# EAGLE design HighSideBoard (EAGLE 5.10)
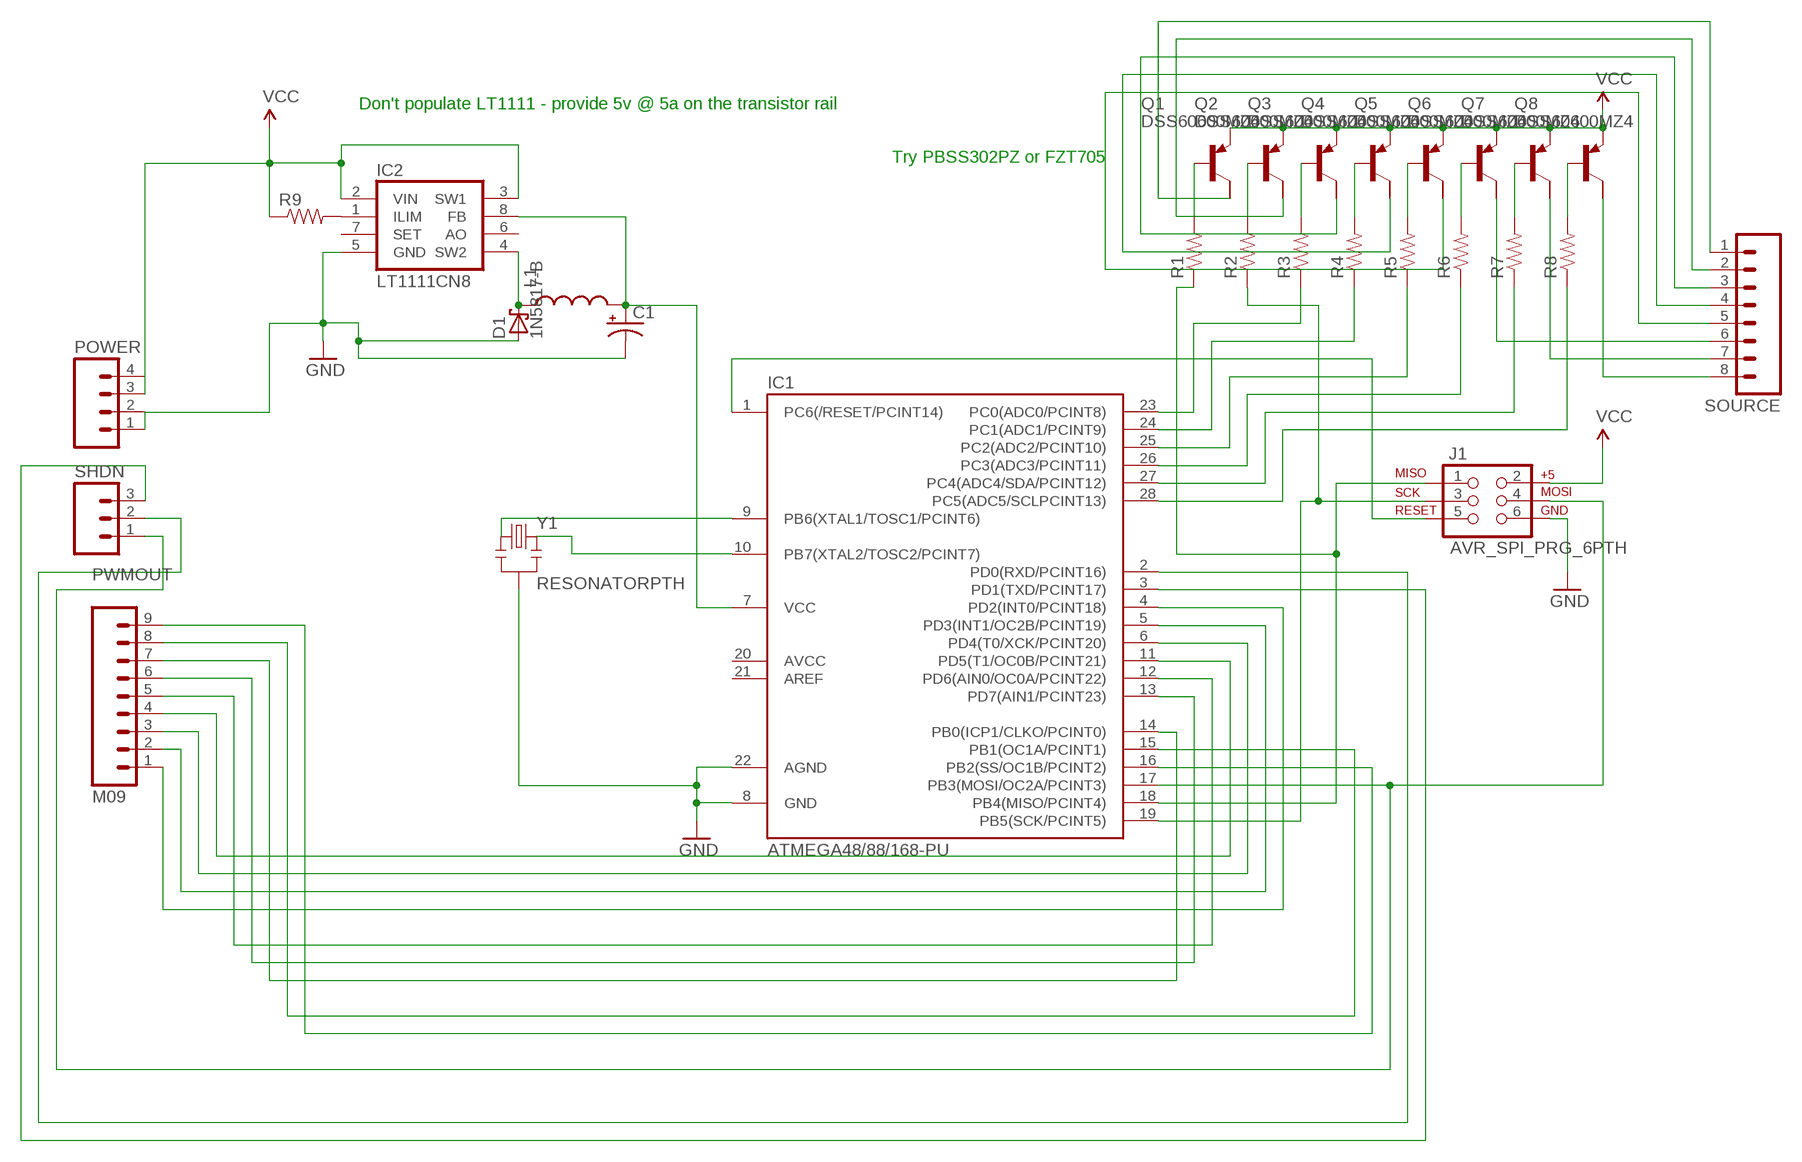
[diagram p0: schematic, sheet 1]

## Parts
C1  CAP_POLPTH2  [CPOL-RADIAL-10UF-25V]
D1  1N5817-B  [DO41-7.6]
IC1  ATMEGA48/88/168-PU  [DIL28-3]
IC2  LT1111CN8  [DIL08]
J1  AVR_SPI_PRG_6PTH  [2X3]
L1  INDUCTORCR75  [CR75]
POWER  M04PTH  [1X04]
PWMOUT  M09  [1X09]
Q1  DSS60600MZ4  FZT753SMD  [SOT223]
Q2  DSS60600MZ4  FZT753SMD  [SOT223]
Q3  DSS60600MZ4  FZT753SMD  [SOT223]
Q4  DSS60600MZ4  FZT753SMD  [SOT223]
Q5  DSS60600MZ4  FZT753SMD  [SOT223]
Q6  DSS60600MZ4  FZT753SMD  [SOT223]
Q7  DSS60600MZ4  FZT753SMD  [SOT223]
Q8  DSS60600MZ4  FZT753SMD  [SOT223]
R1  RESISTORAXIAL-0.3  [AXIAL-0.3]
R2  RESISTORAXIAL-0.3  [AXIAL-0.3]
R3  RESISTORAXIAL-0.3  [AXIAL-0.3]
R4  RESISTORAXIAL-0.3  [AXIAL-0.3]
R5  RESISTORAXIAL-0.3  [AXIAL-0.3]
R6  RESISTORAXIAL-0.3  [AXIAL-0.3]
R7  RESISTORAXIAL-0.3  [AXIAL-0.3]
R8  RESISTORAXIAL-0.3  [AXIAL-0.3]
R9  RESISTORAXIAL-0.3  [AXIAL-0.3]
SHDN  M03PTH  [1X03]
SOURCE  M081X08  [1X08]
Y1  RESONATORPTH  [RESONATOR-PTH]

## Nets
GND: C1.2(-) D1.A IC1.8(GND) IC1.22(AGND) IC2.5(GND) J1.6 POWER.1 POWER.2 Y1.2
N$1: IC1.18(PB4(MISO/PCINT4)) J1.1 R1.P$1
N$2: IC1.19(PB5(SCK/PCINT5)) J1.3 R2.P$1
N$3: IC1.1(PC6(/RESET/PCINT14)) J1.5
N$4: IC1.17(PB3(MOSI/OC2A/PCINT3)) J1.4 SHDN.1
N$5: IC1.4(PD2(INT0/PCINT18)) PWMOUT.1
N$6: IC1.5(PD3(INT1/OC2B/PCINT19)) PWMOUT.2
N$7: IC1.6(PD4(T0/XCK/PCINT20)) PWMOUT.3
N$8: IC1.11(PD5(T1/OC0B/PCINT21)) PWMOUT.4
N$9: IC1.12(PD6(AIN0/OC0A/PCINT22)) PWMOUT.5
N$10: IC1.13(PD7(AIN1/PCINT23)) PWMOUT.6
N$11: IC1.14(PB0(ICP1/CLKO/PCINT0)) PWMOUT.7
N$12: IC1.15(PB1(OC1A/PCINT1)) PWMOUT.8
N$13: IC1.16(PB2(SS/OC1B/PCINT2)) PWMOUT.9
N$14: IC1.9(PB6(XTAL1/TOSC1/PCINT6)) Y1.1
N$15: IC1.10(PB7(XTAL2/TOSC2/PCINT7)) Y1.3
N$16: Q1.1(B) R1.P$2
N$17: Q2.1(B) R2.P$2
N$18: Q3.1(B) R3.P$2
N$19: Q4.1(B) R4.P$2
N$20: Q5.1(B) R5.P$2
N$21: Q6.1(B) R6.P$2
N$22: Q7.1(B) R7.P$2
N$23: Q8.1(B) R8.P$2
N$24: IC1.28(PC5(ADC5/SCLPCINT13)) R8.P$1
N$25: IC1.27(PC4(ADC4/SDA/PCINT12)) R7.P$1
N$26: IC1.26(PC3(ADC3/PCINT11)) R6.P$1
N$27: IC1.25(PC2(ADC2/PCINT10)) R5.P$1
N$28: IC1.24(PC1(ADC1/PCINT9)) R4.P$1
N$29: IC1.23(PC0(ADC0/PCINT8)) R3.P$1
N$30: Q5.2(C) SOURCE.5
N$31: Q6.2(C) SOURCE.6
N$32: Q1.2(C) SOURCE.1
N$33: Q2.2(C) SOURCE.2
N$34: Q3.2(C) SOURCE.3
N$35: Q4.2(C) SOURCE.4
N$36: Q7.2(C) SOURCE.7
N$37: Q8.2(C) SOURCE.8
N$38: IC2.1(ILIM) R9.P$2
N$39: D1.C IC2.4(SW2) L1.P$1
N$40: C1.1(+) IC1.7(VCC) IC2.8(FB) L1.P$2
N$41: IC1.2(PD0(RXD/PCINT16)) SHDN.2
N$42: IC1.3(PD1(TXD/PCINT17)) SHDN.3
VCC: IC2.2(VIN) IC2.3(SW1) J1.2 POWER.3 POWER.4 Q1.3(E) Q2.3(E) Q3.3(E) Q4.3(E) Q5.3(E) Q6.3(E) Q7.3(E) Q8.3(E) R9.P$1
Unconnected: IC1.20(AVCC) IC1.21(AREF) IC2.6(AO) IC2.7(SET) Q1.4(C/) Q2.4(C/) Q3.4(C/) Q4.4(C/) Q5.4(C/) Q6.4(C/) Q7.4(C/) Q8.4(C/)

## Notes on the sheet
- Don't populate LT1111 - provide 5v @ 5a on the transistor rail
- Try PBSS302PZ or FZT705

## Library data of the parts
C1 = SparkFun:CAP_POL: Capacitor Polarized These are standard SMD and PTH capacitors. Normally 10uF, 47uF, and 100uF in electrolytic and tantalum varieties. Always verify the external diameter of the through hole cap, it varies with capacity, voltage, and manufacturer. The EIA devices should be standard.
D1 = diode:1N581*: 1.0A SCHOTTKY BARRIER RECTIFIER Source: http://www.diodes.com/datasheets/ds23001.pdf
IC1 = atmega8:ATMEGA48/88/168-PU
IC2 = linear-technology-2:LT1111*: Micropower DC/DC Converter Adjustable and Fixed 5V, 12V
J1 = SparkFun:AVR_SPI_PRG_6: AVR ISP 6 Pin This is the reduced ISP connector for AVR programming. Common on Arduino. This footprint will take up less PCB space and can be used with a 10-pin to 6-pin adapter such as SKU: BOB-08508
L1 = SparkFun:INDUCTOR: Inductors Basic Inductor/Choke - 0603 and 1206. Footprints are not proven and vary greatly between part numbers.
POWER = SparkFun:M04: Header 4 Standard 4-pin 0.1" header. Use with straight break away headers (SKU : PRT-00116), right angle break away headers (PRT-00553), swiss pins (PRT-00743), machine pins (PRT-00117), and female headers (PRT-00115). Molex polarized connector foot print use with SKU : PRT-08231 with associated crimp pins and housings. 1MM SMD Version SKU: PRT-10208
PWMOUT = SparkFun:M09: Header 9 Standard 9-pin 0.1" header. Use with straight break away headers (SKU : PRT-00116), right angle break away headers (PRT-00553), swiss pins (PRT-00743), machine pins (PRT-00117), and female headers (PRT-00115).
Q1-Q8 = transistor-pnp:FZT753SMD: PNP Transistor
R1-R9 = SparkFun:RESISTOR: Resistor Basic schematic elements and footprints for 0603, 1206, and PTH resistors.
SHDN = SparkFun:M03: Header 3 Standard 3-pin 0.1" header. Use with straight break away headers (SKU : PRT-00116), right angle break away headers (PRT-00553), swiss pins (PRT-00743), machine pins (PRT-00117), and female headers (PRT-00115). Molex polarized connector foot print use with SKU : PRT-08232 with associated crimp pins and housings.
SOURCE = SparkFun:M08: Header 8 Standard 8-pin 0.1" header. Use with straight break away headers (SKU : PRT-00116), right angle break away headers (PRT-00553), swiss pins (PRT-00743), machine pins (PRT-00117), and female headers (PRT-00115).
Y1 = SparkFun:RESONATOR: Resonator Small SMD resonator. This is the itty bitty 10/20MHz resonators with built in caps. CSTCE10M0G55 and CSTCE20M0V53. Footprint has been reviewed closely but hasn't been tested yet.

## Board
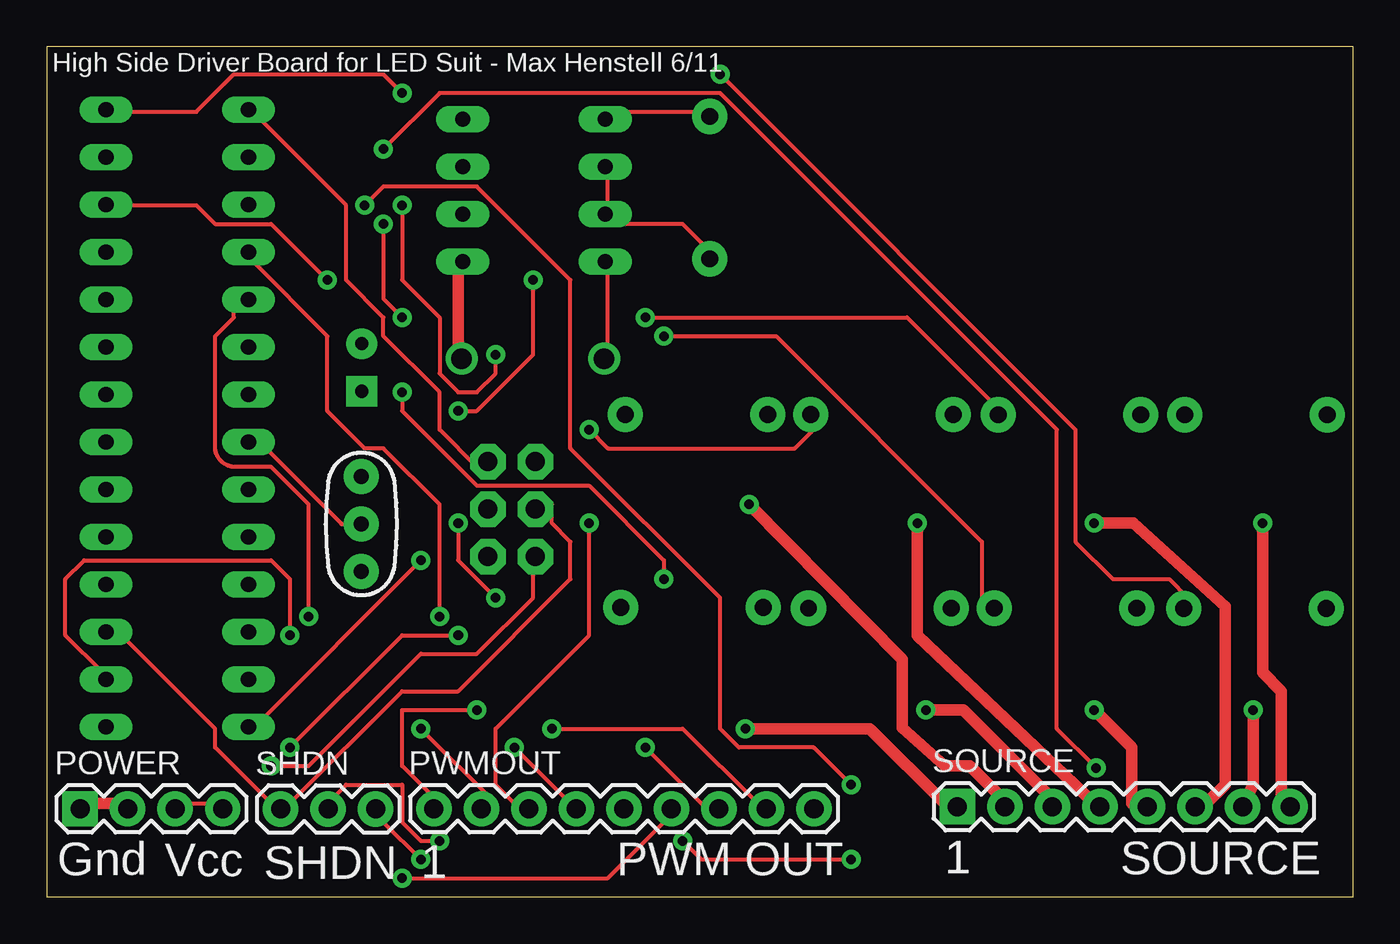
[diagram p1: board, top side]
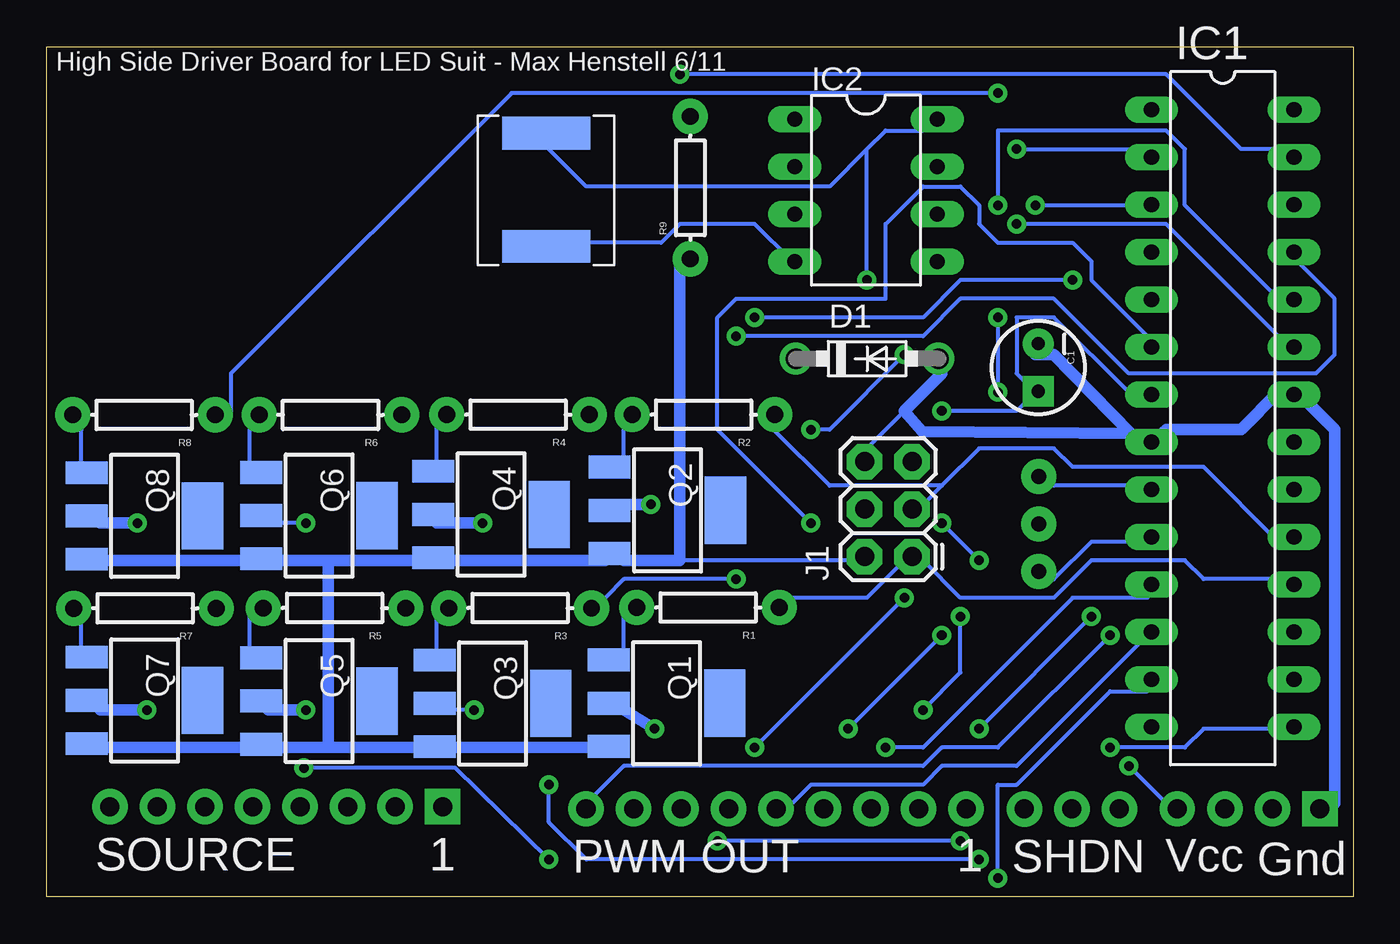
[diagram p2: board, bottom side, seen from below]

Size 69.85 x 45.48 mm. Coordinates in mm from the lower left corner, seen from the top.
Outline: 0,0 69.85,0 69.85,45.48 0,45.48 0,0
Copper layers (1*16): Top 0.035mm / dielectric 1.5mm / Bottom 0.035mm
Design rules "SparkFun": minimum track width 8mil, minimum drill 20mil, track to track 8mil, track to pad 8mil, pad to pad 8mil, via to via 8mil, smd to smd 8mil, copper to edge 10mil, drill to drill 8mil, minimum pad ring 12mil, minimum via ring 10mil, stop-mask expansion 4mil, vias tented up to drill 25mil, thermal gap 10mil

### Footprints (pad centres in the part's own frame; a part is rotated, then mirrored left to right if it is on the bottom)
CPOL-RADIAL-10UF-25V = drill 0.7 pad 1.651 square: 1 1.27,0 | drill 0.7 pad 1.651 round: 2 -1.27,0
DO41-7.6 = drill 1.1 pad 1.7 round: A 3.81,0; C -3.81,0
DIL28-3 = drill 0.813 long: 1 -16.51,-3.81; 2 -13.97,-3.81; 3 -11.43,-3.81; 4 -8.89,-3.81; 5 -6.35,-3.81; 6 -3.81,-3.81; 7 -1.27,-3.81; 8 1.27,-3.81; 9 3.81,-3.81; 10 6.35,-3.81; 11 8.89,-3.81; 12 11.43,-3.81; 13 13.97,-3.81; 14 16.51,-3.81; 15 16.51,3.81; 16 13.97,3.81; 17 11.43,3.81; 18 8.89,3.81; 19 6.35,3.81; 20 3.81,3.81; 21 1.27,3.81; 22 -1.27,3.81; 23 -3.81,3.81; 24 -6.35,3.81; 25 -8.89,3.81; 26 -11.43,3.81; 27 -13.97,3.81; 28 -16.51,3.81
DIL08 = drill 0.813 long: 1 -3.81,-3.81; 2 -1.27,-3.81; 3 1.27,-3.81; 4 3.81,-3.81; 5 3.81,3.81; 6 1.27,3.81; 7 -1.27,3.81; 8 -3.81,3.81
2X3 = drill 1.016 pad 1.88 octagon: 1 0,0; 2 0,2.54; 3 2.54,0; 4 2.54,2.54; 5 5.08,0; 6 5.08,2.54
CR75 = smd 1.75 x 4.7: P$1 0,0; P$2 6.05,0
1X04 = drill 1.016 pad 1.88 square: 1 0,0 | drill 1.016 pad 1.88 round: 2 2.54,0; 3 5.08,0; 4 7.62,0
1X09 = drill 1.016 pad 1.88 round: 1 0,0; 2 2.54,0; 3 5.08,0; 4 7.62,0; 5 10.16,0; 6 12.7,0; 7 15.24,0; 8 17.78,0; 9 20.32,0
SOT223 = smd 1.219 x 2.235: 1 -2.311,-3.099; 2 0,-3.099; 3 2.311,-3.099 | smd 3.6 x 2.2: 4 0,3.099
AXIAL-0.3 = drill 0.9 pad 1.88 round: P$1 -3.81,0; P$2 3.81,0
1X03 = drill 1.016 pad 1.88 round: 1 0,0; 2 2.54,0; 3 5.08,0
1X08 = drill 1.016 pad 1.88 square: 1 0,0 | drill 1.016 pad 1.88 round: 2 2.54,0; 3 5.08,0; 4 7.62,0; 5 10.16,0; 6 12.7,0; 7 15.24,0; 8 17.78,0
RESONATOR-PTH = drill 0.8 pad 1.88 round: 1 -2.54,0; 2 0,0; 3 2.54,0

### Placement (x,y rotation side)
C1  16.84,28.32 270 bottom
D1  25.99,28.79 0 bottom
IC1  6.98,25.6 270 bottom
IC2  26.05,37.8 270 bottom
J1  23.59,18.2 90 bottom
L1  43.15,34.8 90 bottom
POWER  1.78,4.72 0 top
PWMOUT  20.7,4.72 0 top
Q1  36.71,10.36 270 bottom
Q2  36.66,20.68 270 bottom
Q3  46.01,10.35 270 bottom
Q4  46.09,20.46 270 bottom
Q5  55.29,10.48 270 bottom
Q6  55.29,20.4 270 bottom
Q7  64.62,10.51 270 bottom
Q8  64.62,20.38 270 bottom
R1  34.49,15.48 180 bottom
R2  34.73,25.8 180 bottom
R3  44.54,15.45 180 bottom
R4  44.65,25.8 180 bottom
R5  54.46,15.45 180 bottom
R6  54.68,25.79 180 bottom
R7  64.59,15.44 180 bottom
R8  64.65,25.79 180 bottom
R9  35.44,37.94 90 bottom
SHDN  12.5,4.7 0 top
SOURCE  48.69,4.83 0 top
Y1  16.82,19.95 270 top

### Tracks (layer width: path | path; a pad name or v marks a point on that pad's centre or on a via)
GND
  Top 0.203: 22,34 IC2.5 | D1.A 22,29 | Y1.2 15.77,19.95 11.38,24.34 11.37,24.34 11.28,24.25 10.87,24.25 IC1.8
  Top 0.61: 22,29 22,34 | POWER.1 2,5 4,5 POWER.2
  Bottom 0.203: 24,26 26,24 J1.6 | IC1.8 11,24 | 3,27 IC1.22
  Bottom 0.61: D1.A 22,28 24,26 23.05,24.9 11.9,24.8 | IC1.8 10,25 6,25 4,27 IC1.22 | 11,24 11.9,24.8 | 11.9,24.8 16,29 17,29 C1.2 | 3,27 1,25 1,5 POWER.1
N$1
  Bottom 0.203: IC1.18 4,17 8,17 9,18 14,18 16,16 21,16 23,18 J1.1 24,18 26,16 30,16 R1.P$1
N$2
  Bottom 0.203: 22,22 23,21 J1.3 | 22,22 20,24 16,24 15,23 8,23 4,19 IC1.19 | 22,22 28,22 31,25 R2.P$1
N$3
  Top 0.203: IC1.1 11,42 16,37 16,33 18,31 18,30 21,27 21,25 23,23 J1.5
N$4
  Top 0.203: IC1.17 4,14 9,9 9,8 12,5 SHDN.1 13,5 19,11 22,11 28,17 28,19 27,20 27,21 J1.4
N$5  (via drill 0.51)
  Top 0.203: v21,15 21,21 18,24 17,24 15,26 15,30 11,34 IC1.4 | v23,10 19,10 19,7 21,5 PWMOUT.1
  Bottom 0.203: v21,15 21,12 v23,10
N$6  (via drill 0.51)
  Top 0.203: v14,15 14,21 12,23 10.08,23 arc-90 9,24.08 9,30 10,31 10,32 IC1.5 | v20,9 24,5 PWMOUT.2
  Bottom 0.203: v20,9 v14,15
N$7  (via drill 0.51)
  Top 0.203: v29,20 29,14 24,9 24,6 25,5 PWMOUT.3
  Bottom 0.203: v29,20 34,25 34,31 33,32 25,32 25,36 23,38 21,38 20,37 20,36 19,35 15,35 14,34 14,33 11,30 IC1.6
N$8  (via drill 0.51)
  Top 0.203: v25,8 28,5 PWMOUT.4
  Bottom 0.203: v25,8 23,8 15,16 11,16 IC1.11
N$9
  Bottom 0.203: IC1.12 11,14 18,7 22,7 23,6 29,6 30,5 PWMOUT.5
N$10  (via drill 0.51)
  Top 0.203: v19,1 30,1 33,4 PWMOUT.6
  Bottom 0.203: v19,1 19,6 18,6 13,11 11,11 IC1.13
N$11  (via drill 0.51)
  Top 0.203: v20,18 11,9 IC1.14 | v22,20 22,18 v24,16 | v32,8 36,4 PWMOUT.7
  Bottom 0.203: v20,18 v22,20 | v24,16 v32,8
N$12  (via drill 0.51)
  Top 0.203: v13,8 19,14 v22,14 | v27,9 34,9 38,5 PWMOUT.8
  Bottom 0.203: v13,8 9,8 8,9 4,9 IC1.15 | v22,14 v27,9
N$13  (via drill 0.51)
  Top 0.203: v13,14 13,17 12,18 2,18 1,17 1,14 3,12 IC1.16
  Bottom 0.203: v13,14 19,8 22,8 23,7 39,7 41,5 PWMOUT.9
N$14
  Bottom 0.203: IC1.9 11,22 16,22 Y1.1
N$15
  Bottom 0.203: IC1.10 11,19 14,19 16,17 Y1.3
N$16
  Bottom 0.203: Q1.1 39,13 39,15 R1.P$2
N$17
  Bottom 0.203: Q2.1 39,23 39,25 R2.P$2
N$18
  Bottom 0.203: Q3.1 49,13 49,15 R3.P$2
N$19
  Bottom 0.203: Q4.1 49,23 49,26 R4.P$2
N$20
  Bottom 0.203: Q5.1 59,13 59,15 R5.P$2
N$21
  Bottom 0.203: Q6.1 59,23 59,25 R6.P$2
N$22
  Bottom 0.203: Q7.1 68,13 68,15 R7.P$2
N$23
  Bottom 0.203: Q8.1 68,23 68,25 R8.P$2
N$24  (via drill 0.51)
  Top 0.203: v19,43 18,44 10,44 8,42 4,42 IC1.28
  Bottom 0.203: v19,43 45,43 60,28 60,26 R8.P$1
N$25  (via drill 0.51)
  Top 0.203: v36,44 55,25 55,19 57,17 60,17 61,16 R7.P$1
  Bottom 0.203: v36,44 10,44 6,40 4,40 IC1.27
N$26  (via drill 0.51)
  Top 0.203: v15,33 12,36 9,36 8,37 4,37 IC1.26 | v32,31 46,31 51,26 R6.P$1
  Bottom 0.203: v15,33 21,33 23,31 v32,31
N$27  (via drill 0.51)
  Top 0.203: v33,30 39,30 50,19 50,16 R5.P$1
  Bottom 0.203: v33,30 23,30 21,32 16,32 12,28 2,28 1,29 1,32 3,34 IC1.25
N$28  (via drill 0.51)
  Top 0.203: v19,37 19,33 21,31 21,28 22,27 23,27 24,28 v24,29 | v29,25 30,24 40,24 41,25 R4.P$1
  Bottom 0.203: v19,37 19,41 10,41 9,40 9,37 4,32 IC1.24 | v24,29 28,25 v29,25
N$29  (via drill 0.51)
  Top 0.203: v18,36 18,32 v19,31 | v19,27 19,26 23,22 29,22 33,18 v33,17
  Bottom 0.203: v18,36 10,36 4,30 IC1.23 | v19,31 v19,27 | v33,17 39,17 40,16 R3.P$1
N$30  (via drill 0.51)
  Top 0.61: v56,10 58,8 58,5 SOURCE.5
  Bottom 0.203: 58,10 Q5.2
  Bottom 0.61: v56,10 58,10
N$31  (via drill 0.51)
  Top 0.61: v56,20 58.1,20 63,15.55 63,6 62,5 SOURCE.6
  Bottom 0.203: v56,20 58,20 Q6.2
N$32  (via drill 0.51)
  Top 0.61: v37.35,9 44,9 48,5 SOURCE.1
  Bottom 0.203: 39,10 Q1.2
  Bottom 0.61: v37.35,9 39,10
N$33  (via drill 0.51)
  Top 0.61: v37.55,21 45.75,12.7 45.75,9.05 48,7 49.35,7 51.35,5 SOURCE.2
  Bottom 0.203: 39,21 Q2.2
  Bottom 0.61: v37.55,21 39,21
N$34  (via drill 0.51)
  Top 0.61: v47,10 49,10 54,5 SOURCE.3
  Bottom 0.203: v47,10 49,10 Q3.2
N$35  (via drill 0.51)
  Top 0.61: v46.55,20 46.55,14 56,5 SOURCE.4
  Bottom 0.203: 49,20 Q4.2
  Bottom 0.61: v46.55,20 49,20
N$36  (via drill 0.51)
  Top 0.61: v64.5,10 64.5,6 64,5 SOURCE.7
  Bottom 0.203: 67,10 Q7.2
  Bottom 0.61: v64.5,10 67,10
N$37  (via drill 0.51)
  Top 0.61: v65,20 65,12 66,11 66,5 SOURCE.8
  Bottom 0.203: 67,20 Q8.2
  Bottom 0.61: v65,20 67,20
N$38
  Top 0.203: IC2.1 30,42 35,42 R9.P$2
N$39
  Top 0.203: IC2.4 30,34 30,29 D1.C
  Bottom 0.203: L1.P$1 43,35 37,35 36,36 32,36 30,34 IC2.4
N$40  (via drill 0.51)
  Top 0.203: v22,26 23,26 26,29 v26,33
  Bottom 0.203: 17,27 18,28 18,31 16,31 12,27 11,27 IC1.7 | 26,40 28,38 41,38 43,40 L1.P$2 | 26,40 25,41 23,41 IC2.8 | 17,27 18,26 v22,26 | v26,33 26,40 | 17,27 C1.1
N$41  (via drill 0.51)
  Top 0.203: v18,40 21,43 36,43 54,25 54,9 v56.1,6.9 | v43,2 35,2 v34,3 | v21,3 20,3 19,4 19,6 16,6 15,5 SHDN.2
  Bottom 0.203: v18,40 11,40 IC1.2 | v56.1,6.9 48,6.9 v43,2 | v21,3 v34,3
N$42  (via drill 0.51)
  Top 0.203: v17,37 18,38 23,38 28,33 28,24 36,16 36,9 37,8 41,8 v43,6 | v20,2 18,4 SHDN.3
  Bottom 0.203: v17,37 11,37 IC1.3 | v43,6 43,4 41,2 v20,2
VCC  (via drill 0.51)
  Top 0.203: IC2.2 30,39 30,37 IC2.3 30,36 34,36 35,35 R9.P$1 | POWER.3 7,5 9,5 POWER.4 | v12,7 14,7 20,13 23,13 26,16 26,18 J1.2
  Bottom 0.203: 50,8 Q3.3 49,8 | 58,8 Q5.3 59,8 | 40,8 Q1.3 | 67,8 Q7.3 | 50,18 Q4.3 49,18 | 58,18 Q6.3 59,18 | 67,18 Q8.3 | 40,18 Q2.3 39,18 | 36,18 27,18 J1.2 | v12,7 10,5 POWER.4
  Bottom 0.61: 54.8,8 58,8 | 54.8,8 50,8 | 49,8 40,8 | 59,8 67,8 | 54.8,18 58,18 | 50,18 54.8,18 | 59,18 67,18 | 40,18 49,18 | 39,18 36,18 36,34 R9.P$1 | 54.8,18 54.8,8

### Text on the board
tPlace: High Side Driver Board for LED Suit - Max Henstell 6/11 | Gnd | Vcc | SHDN | 1 | PWM OUT | 1 | SOURCE
bPlace: High Side Driver Board for LED Suit - Max Henstell 6/11 | Gnd | Vcc | SHDN | 1 | PWM OUT | 1 | SOURCE